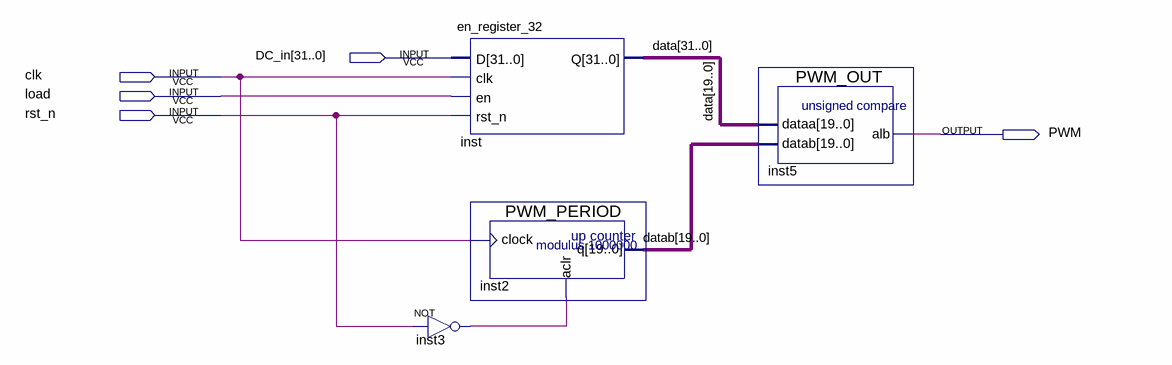
[diagram p0: schematic sheet]
// Quartus schematic PWM.bdf as structural Verilog: 4 symbols, 5 pins
module PWM (
  input  [31:0] DC_in,
  input  clk,
  input  load,
  input  rst_n,
  output PWM
);

  wire inst3_out;
  wire [19:0] datab;
  wire [31:0] data;

  not inst3 (inst3_out, rst_n);
  en_register_32 inst (.D(DC_in), .clk(clk), .en(load), .rst_n(rst_n), .Q(data));
  PWM_PERIOD inst2 (.clock(clk), .aclr(inst3_out), .q(datab));
  PWM_OUT inst5 (.dataa(data[19:0]), .datab(datab), .alb(PWM));
endmodule
